# EasyEDA schematic RGB_LED_Control.json
TITLE: Complate Circuit; REV: 1.0; Date: 2023-01-20; Sheet: 1/1; Drawn By: Cihangir; Company: Suwiiiiiii
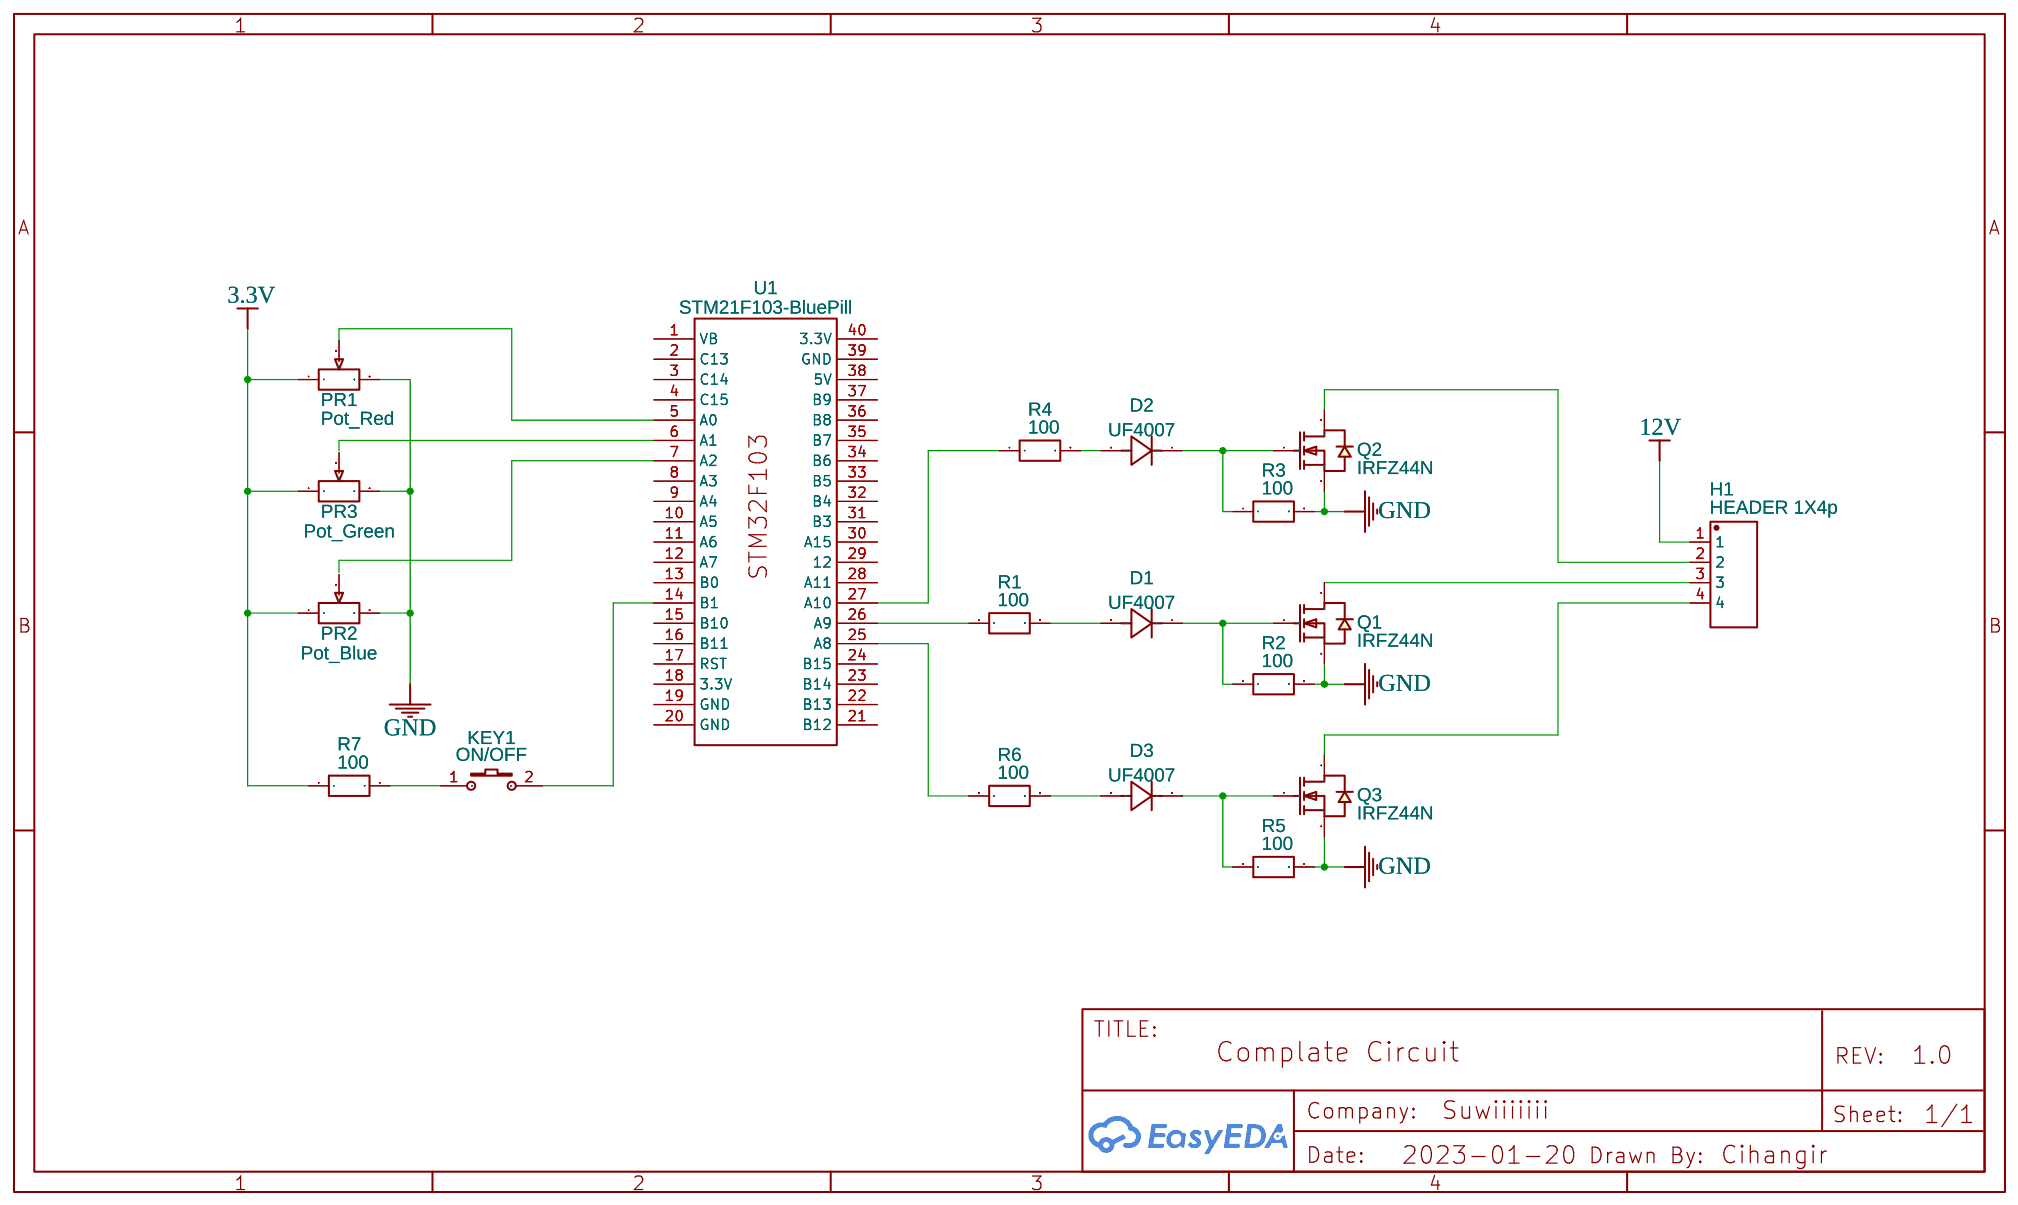
[diagram p0: schematic sheet]

## Parts
D1  UF4007  [ДИОД UF4007]
D2  UF4007  [ДИОД UF4007]
D3  UF4007  [ДИОД UF4007]
H1  HEADER 1X4p  [HEADER - HEADER-FEMALE-2.54_1X4]
KEY1  ON/OFF  [KEY-SMD_2P-L6.2-W3.6-LS8.0]
PR1  Pot_Red  [WH160-1-104]
PR2  Pot_Blue  [WH160-1-104]
PR3  Pot_Green  [WH160-1-104]
Q1  IRFZ44N  [IRFZ44N]
Q2  IRFZ44N  [IRFZ44N]
Q3  IRFZ44N  [IRFZ44N]
R1  100  [R0603]
R2  100  [R0603]
R3  100  [R0603]
R4  100  [R0603]
R5  100  [R0603]
R6  100  [R0603]
R7  100  [R0603]
U1  STM21F103-BluePill  [STM32F103-BLUEPILL]

## Library data of the parts
D1-D3 = UF4007: Supplier: LCSC; Supplier Part: C9900004719; JLCPCB Part Class: Extended Part; Contributor: ozz beorn
H1 = HEADER 1X4p: Contributor: trananhkha2406; Supplier: Sparkfun
KEY1 = K2-3.6×6.1_SMD: Supplier Part: C118141; Supplier: LCSC; Manufacturer Part: K2-1107ST-A4SW-06; Contributor: LCEDA_Lib; 制造商: 韩国韩荣
PR1-PR3 = Potentiometer copy: Tolerance: ±25%; Supplier Part: C61836; Supplier: LCSC; Manufacturer: JML; Manufacturer Part: Potentiometer WH160-1-104
Q1-Q3 = IRFZ44N: Contributor: rocktronica
R1-R7 = R_0603_EU: Contributor: LCEDA_Lib
U1 = STM21F103-BluePill: Contributor: Lutfito danuega

## Nets
3.3V: PR1.1 PR2.1 PR3.1 R7.1
12V: H1.1
GND: PR1.3 PR2.3 PR3.3 Q1.3(S) Q2.3(S) Q3.3(S) R2.2 R3.2 R5.2
Net-(D1-1): D1.1(K) Q1.1(G) R2.1
Net-(D1-2): D1.2(A) R1.2
Net-(D2-1): D2.1(K) Q2.1(G) R3.1
Net-(D2-2): D2.2(A) R4.2
Net-(D3-1): D3.1(K) Q3.1(G) R5.1
Net-(D3-2): D3.2(A) R6.2
Net-(H1-2): H1.2 Q2.2(D)
Net-(H1-3): H1.3 Q1.2(D)
Net-(H1-4): H1.4 Q3.2(D)
Net-(KEY1-1): KEY1.1 R7.2
Net-(KEY1-2): KEY1.2 U1.14(B1)
Net-(PR1-2): PR1.2 U1.5(A0)
Net-(R1-1): R1.1 U1.26(A9)
Net-(R4-1): R4.1 U1.27(A10)
Net-(R6-1): R6.1 U1.25(A8)

Not connected (* = marked no-connect by the designer): PR2 2; PR3 2; U1 1(VB) 2(C13) 3(C14) 4(C15) 6(A1) 7(A2) 8(A3) 9(A4) 10(A5) 11(A6) 12(A7) 13(B0) 15(B10) 16(B11) 17(RST) 18(3.3V) 19(GND) 20(GND) 21(B12) 22(B13) 23(B14) 24(B15) 28(A11) 29(12) 30(A15) 31(B3) 32(B4) 33(B5) 34(B6) 35(B7) 36(B8) 37(B9) 38(5V) 39(GND) 40(3.3V)
